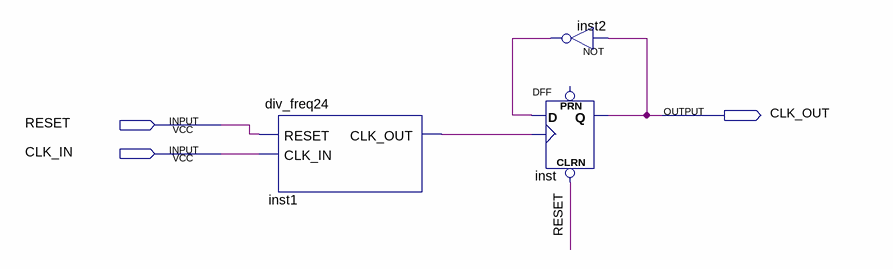
[diagram p0: schematic sheet]
// Quartus schematic div_freq25.bdf as structural Verilog: 3 symbols, 3 pins
module div_freq25 (
  input  RESET,
  input  CLK_IN,
  output CLK_OUT
);

  wire inst1_clk_out, inst2_out;

  div_freq24 inst1 (.RESET(RESET), .CLK_IN(CLK_IN), .CLK_OUT(inst1_clk_out));
  not inst2 (inst2_out, CLK_OUT);
  DFF inst (.CLRN(RESET), .CLK(inst1_clk_out), .D(inst2_out), .Q(CLK_OUT));  // open: PRN
endmodule
